# EAGLE board Open Flight Controller (EAGLE 9.0.0)
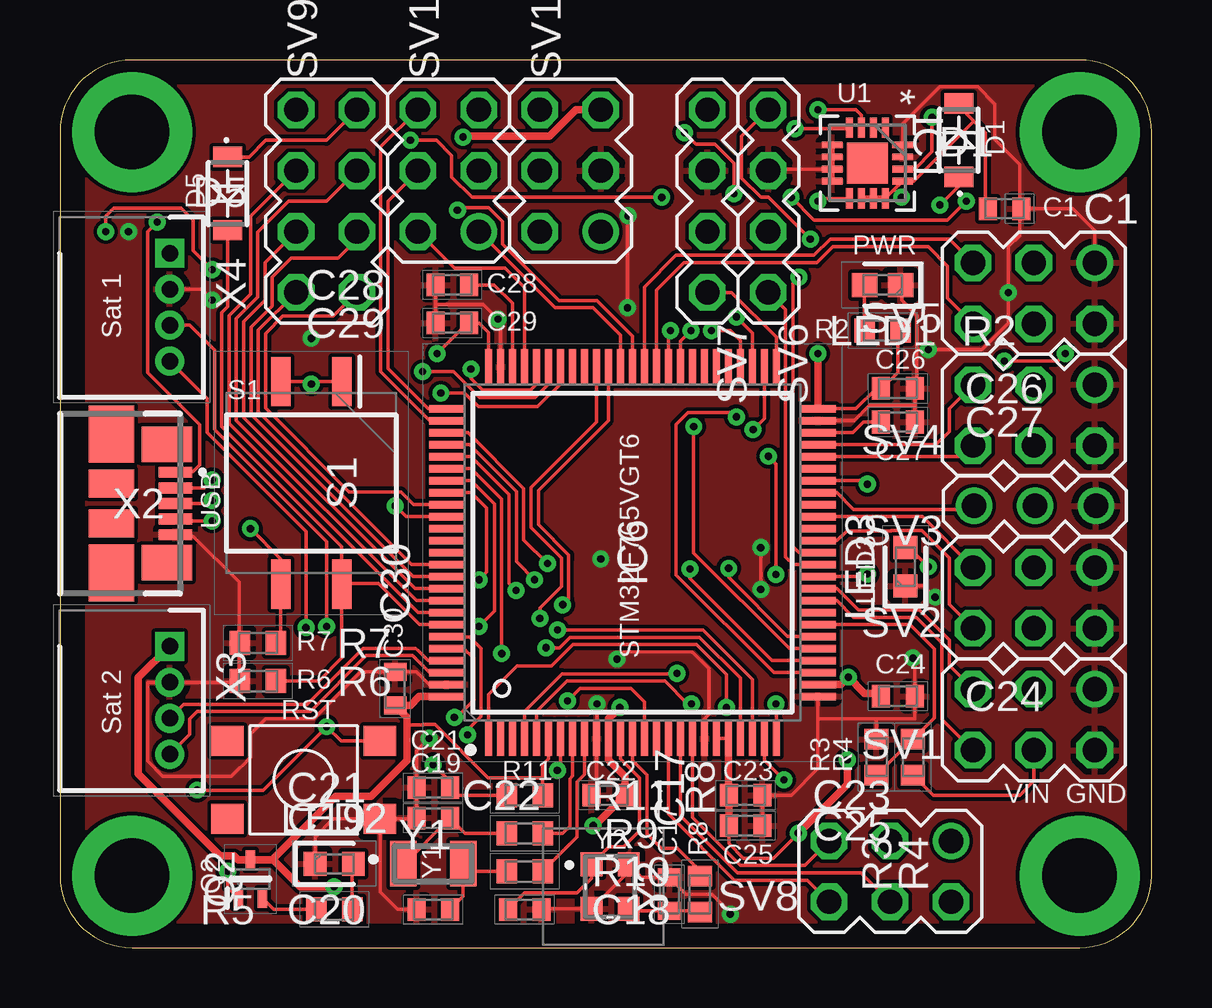
[diagram p2: board, top side]
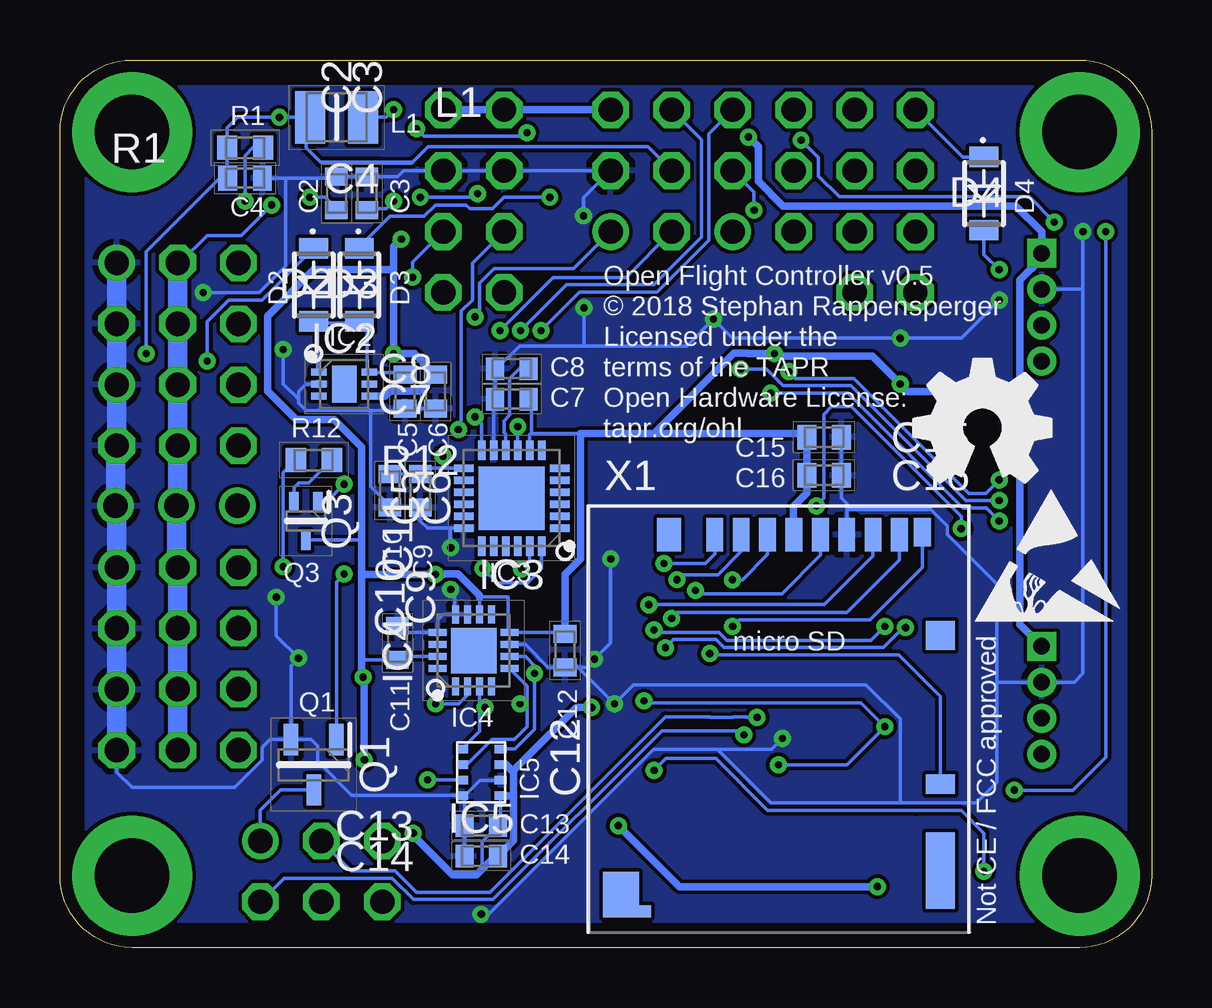
[diagram p3: board, bottom side, seen from below]

Size 45.5 x 37 mm. Coordinates in mm from the lower left corner, seen from the top.
Outline: 0,3 arc90 3,0 42.5,0 arc90 45.5,3 45.5,34 arc90 42.5,37 3,37 arc90 0,34 0,3
Copper layers (1*16): Top 0.035mm / dielectric 1.5mm / Bottom 0.035mm
Design rules "default *": minimum track width 6mil, minimum drill 0.3mm, track to track 6mil, track to pad 6mil, pad to pad 6mil, via to via 6mil, smd to smd 6mil, copper to edge 40mil, drill to drill 6mil, minimum pad ring 10mil, minimum via ring 8mil, stop-mask expansion 4mil, vias tented up to drill 3mm, thermal gap 10mil

## Footprints (pad centres in the part's own frame; a part is rotated, then mirrored left to right if it is on the bottom)
CAPC1608X90N = smd 0.75 x 0.94: 1 -0.7,0; 2 0.7,0
CAPC1608X100N = smd 0.79 x 1.02: 1 -0.72,0; 2 0.72,0
PMDU = smd 1.2 x 0.85: 1 0,1.525; 2 0,-1.525
RGT16_1P7X1P7 = smd 0.85 x 0.28: 1 -1.475,0.75; 2 -1.475,0.25; 3 -1.475,-0.25; 4 -1.475,-0.75; 9 1.475,-0.75; 10 1.475,-0.25; 11 1.475,0.25; 12 1.475,0.75 | smd 0.28 x 0.85: 5 -0.75,-1.475; 6 -0.25,-1.475; 7 0.25,-1.475; 8 0.75,-1.475; 13 0.75,1.475; 14 0.25,1.475; 15 -0.25,1.475; 16 -0.75,1.475 | smd 1.7 x 1.7: 17 0,0
SON50P200X200X80-7N = smd 0.65 x 0.3: 1 -1.05,0.5; 2 -1.05,0; 3 -1.05,-0.5; 4 1.05,-0.5; 5 1.05,0; 6 1.05,0.5 | smd 1.02 x 1.55: 7 0,0
QFN50P400X400X95-25N = smd 0.8 x 0.3: 1 -2,1.25; 2 -2,0.75; 3 -2,0.25; 4 -2,-0.25; 5 -2,-0.75; 6 -2,-1.25; 13 2,-1.25; 14 2,-0.75; 15 2,-0.25; 16 2,0.25; 17 2,0.75; 18 2,1.25 | smd 0.3 x 0.8: 7 -1.25,-2; 8 -0.75,-2; 9 -0.25,-2; 10 0.25,-2; 11 0.75,-2; 12 1.25,-2; 19 1.25,2; 20 0.75,2; 21 0.25,2; 22 -0.25,2; 23 -0.75,2; 24 -1.25,2 | smd 2.75 x 2.65: 25 0,0
QFN50P300X300X80-17N = smd 0.75 x 0.3: 1 -1.5,0.75; 2 -1.5,0.25; 3 -1.5,-0.25; 4 -1.5,-0.75; 9 1.5,-0.75; 10 1.5,-0.25; 11 1.5,0.25; 12 1.5,0.75 | smd 0.3 x 0.75: 5 -0.75,-1.5; 6 -0.25,-1.5; 7 0.25,-1.5; 8 0.75,-1.5; 13 0.75,1.5; 14 0.25,1.5; 15 -0.25,1.5; 16 -0.75,1.5 | smd 1.9 x 1.9: 17 0,0
8-PIN-METAL-LID-LGA = smd 0.5 x 0.35: 1 0.8,0.975; 2 0.8,0.325; 3 0.8,-0.325; 4 0.8,-0.975; 5 -0.8,-0.975; 6 -0.8,-0.325; 7 -0.8,0.325; 8 -0.8,0.975
QFP50P1600X1600X160-100N = smd 1.475 x 0.3: 1 -7.738,6; 2 -7.738,5.5; 3 -7.738,5; 4 -7.738,4.5; 5 -7.738,4; 6 -7.738,3.5; 7 -7.738,3; 8 -7.738,2.5; 9 -7.738,2; 10 -7.738,1.5; 11 -7.738,1; 12 -7.738,0.5; 13 -7.738,0; 14 -7.738,-0.5; 15 -7.738,-1; 16 -7.738,-1.5; 17 -7.738,-2; 18 -7.738,-2.5; 19 -7.738,-3; 20 -7.738,-3.5; 21 -7.738,-4; 22 -7.738,-4.5; 23 -7.738,-5; 24 -7.738,-5.5; 25 -7.738,-6; 51 7.738,-6; 52 7.738,-5.5; 53 7.738,-5; 54 7.738,-4.5; 55 7.738,-4; 56 7.738,-3.5; 57 7.738,-3; 58 7.738,-2.5; 59 7.738,-2; 60 7.738,-1.5; 61 7.738,-1; 62 7.738,-0.5; 63 7.738,0; 64 7.738,0.5; 65 7.738,1; 66 7.738,1.5; 67 7.738,2; 68 7.738,2.5; 69 7.738,3; 70 7.738,3.5; 71 7.738,4; 72 7.738,4.5; 73 7.738,5; 74 7.738,5.5; 75 7.738,6 | smd 0.3 x 1.475: 26 -6,-7.738; 27 -5.5,-7.738; 28 -5,-7.738; 29 -4.5,-7.738; 30 -4,-7.738; 31 -3.5,-7.738; 32 -3,-7.738; 33 -2.5,-7.738; 34 -2,-7.738; 35 -1.5,-7.738; 36 -1,-7.738; 37 -0.5,-7.738; 38 0,-7.738; 39 0.5,-7.738; 40 1,-7.738; 41 1.5,-7.738; 42 2,-7.738; 43 2.5,-7.738; 44 3,-7.738; 45 3.5,-7.738; 46 4,-7.738; 47 4.5,-7.738; 48 5,-7.738; 49 5.5,-7.738; 50 6,-7.738; 76 6,7.738; 77 5.5,7.738; 78 5,7.738; 79 4.5,7.738; 80 4,7.738; 81 3.5,7.738; 82 3,7.738; 83 2.5,7.738; 84 2,7.738; 85 1.5,7.738; 86 1,7.738; 87 0.5,7.738; 88 0,7.738; 89 -0.5,7.738; 90 -1,7.738; 91 -1.5,7.738; 92 -2,7.738; 93 -2.5,7.738; 94 -3,7.738; 95 -3.5,7.738; 96 -4,7.738; 97 -4.5,7.738; 98 -5,7.738; 99 -5.5,7.738; 100 -6,7.738
INDC2520X120N = smd 1.25 x 2.2: 1 -1.1,0; 2 1.1,0
LEDC1608X100N = smd 1.05 x 1: 1 -0.75,0; 2 0.75,0
LEDC1608X100N' = smd 0.95 x 1: 1 -0.8,0; 2 0.8,0
SOT95P237X112-3N = smd 1.3 x 0.6: 1 -1.05,0.95; 2 -1.05,-0.95; 3 1.05,0
SOT50P160X90-3N = smd 0.8 x 0.4: 1 -0.8,0.5; 2 -0.8,-0.5; 3 0.8,0
RESC1608X50N = smd 0.85 x 1: 1 -0.75,0; 2 0.75,0
SOP254P930X455-4N = smd 2.05 x 0.8: 1 -4.225,2.54; 2 -4.225,0; 3 4.225,0; 4 4.225,2.54
TS-1187-3.8 = smd 1.35 x 1.25: P$1 -3.175,1.625; P$2 3.175,1.625; P$3 -3.175,-1.625; P$4 3.175,-1.625
MA03-2 = drill 1.016: 1 -2.54,-1.27 | drill 1.016 octagon: 2 -2.54,1.27; 3 0,-1.27; 4 0,1.27; 5 2.54,-1.27; 6 2.54,1.27
MA03-1 = drill 1.016: 1 -2.54,0; 2 0,0; 3 2.54,0
MA04-1 = drill 1.016 octagon: 1 -3.81,0; 2 -1.27,0; 3 1.27,0; 4 3.81,0
MA04-2 = drill 1.016 octagon: 1 -3.81,-1.27; 2 -3.81,1.27; 3 -1.27,-1.27; 4 -1.27,1.27; 5 1.27,-1.27; 6 1.27,1.27; 7 3.81,-1.27; 8 3.81,1.27
DM3BT-DSF-PEJS = smd 0.7 x 1.4: 1 -10,0.7; 2 -8.9,0.7; 3 -7.8,0.7; 4 -6.7,0.7; 5 -5.6,0.7; 6 -4.5,0.7; 7 -3.4,0.7; 8 -2.3,0.7 | smd 1.2 x 0.8: A -0.6,-9.7 | smd 0.7 x 1.2: B -1.35,0.8 | smd 1.2 x 3.2: P$1 -0.6,-13.3 | smd 1.2 x 1.2: P$3 -0.6,-3.5 | smd 1 x 1.4: P$13 -11.9,0.7 | smd 1.5 x 1.9: P$14 -13.9,-14.3 | smd 0.5 x 0.5: P$15 -12.9,-15
0473460001 = smd 1.38 x 0.45: 1 4.81,1.3; 2 4.81,0.65; 3 4.81,0; 4 4.81,-0.65; 5 4.81,-1.3 | smd 2.1 x 1.475: 6 4.45,2.462; 7 4.45,-2.462 | smd 1.9 x 2.375: 8 2.15,2.902; 9 2.15,-2.902 | smd 1.9 x 1.175: 10 2.15,0.838; 11 2.15,-0.838
SHDR4W50P0X150_1X4_750X600X370 = drill 0.7 pad 1.1 square: 1 0,0 | drill 0.7 pad 1.1: 2 1.5,0; 3 3,0; 4 4.5,0
ABS-07 = smd 1.1 x 1.9: 1 -1.25,0; 2 1.25,0
MCSJK7E2500101060B10 = smd 1 x 0.9: 1 -0.925,-0.388; 2 0.925,-0.388; 3 0.925,1.162; 4 -0.925,1.162

## Placement (x,y rotation side)
C1  10uF  [CAPC1608X90N]  39.37,30.8 0 top
C2  0.1uF  [CAPC1608X90N]  33.97,31.43 90 bottom
C3  3.3nF  [CAPC1608X90N]  32.7,31.43 90 bottom
C4  22uF  [CAPC1608X100N]  37.78,32.07 0 bottom
C5  1uF  [CAPC1608X90N]  31.11,23.18 270 bottom
C6  1uF  [CAPC1608X90N]  29.84,23.18 270 bottom
C7  10nF  [CAPC1608X90N]  26.67,22.86 180 bottom
C8  0.47uF  [CAPC1608X90N]  26.67,24.13 180 bottom
C9  0.1uF  [CAPC1608X90N]  30.48,19.05 270 bottom
C10  2.2uF  [CAPC1608X90N]  31.75,19.05 270 bottom
C11  0.1uF  [CAPC1608X90N]  31.43,12.7 90 bottom
C12  0.1uF  [CAPC1608X90N]  24.45,12.38 270 bottom
C13  0.1uF  [CAPC1608X90N]  27.94,5.08 180 bottom
C14  0.1uF  [CAPC1608X90N]  27.94,3.81 180 bottom
C15  22uF  [CAPC1608X100N]  13.65,21.27 0 bottom
C16  22uF  [CAPC1608X100N]  13.65,19.68 0 bottom
C17  3pF  [CAPC1608X90N]  25.4,2.22 90 top
C18  3pF  [CAPC1608X90N]  19.37,1.59 0 top
C19  1.2pF  [CAPC1608X90N]  15.56,5.4 180 top
C20  1.2pF  [CAPC1608X90N]  15.56,1.59 180 top
C21  0.1uF  [CAPC1608X90N]  15.56,6.67 180 top
C22  0.1uF  [CAPC1608X90N]  22.86,6.35 180 top
C23  0.1uF  [CAPC1608X90N]  28.57,6.35 0 top
C24  0.1uF  [CAPC1608X90N]  34.92,10.48 0 top
C25  0.1uF  [CAPC1608X90N]  28.57,5.08 0 top
C26  0.1uF  [CAPC1608X90N]  34.92,23.3 0 top
C27  2.2uF  [CAPC1608X90N]  34.92,21.91 0 top
C28  2.2uF  [CAPC1608X90N]  16.35,27.62 180 top
C29  0.1uF  [CAPC1608X90N]  16.35,26.04 180 top
C30  0.1uF  [CAPC1608X90N]  13.97,10.79 90 top
D1  [PMDU]  37.47,33.66 180 top
D2  [PMDU]  34.92,27.62 0 bottom
D3  [PMDU]  33.02,27.62 0 bottom
D4  [PMDU]  6.99,31.43 0 bottom
D5  [PMDU]  6.99,31.43 0 top
IC1  TPS62133RGTT  [RGT16_1P7X1P7]  33.66,32.7 270 top
IC2  LDL112PU33R  [SON50P200X200X80-7N]  33.66,23.5 0 bottom
IC3  ICM-20689-V2.2  [QFN50P400X400X95-25N]  26.67,18.73 180 bottom
IC4  AK8963N  [QFN50P300X300X80-17N]  28.26,12.38 90 bottom
IC5  BMP280  [8-PIN-METAL-LID-LGA]  27.94,7.3 180 bottom
IC6  STM32F765VGT6  [QFP50P1600X1600X160-100N]  23.86,16.46 90 top
L1  2.2uH  [INDC2520X120N]  33.97,34.61 0 bottom
LED1  GREEN  [LEDC1608X100N]  34.29,27.62 180 top
LED2  BLUE  [LEDC1608X100N']  11.43,3.49 0 top
LED3  BLUE  [LEDC1608X100N']  35.24,15.88 90 top
Q1  IRLML6244TRPBF  [SOT95P237X112-3N]  34.92,7.62 270 bottom
Q2  SDTC114EET1G  [SOT50P160X90-3N]  7.94,2.86 90 top
Q3  SDTC114EET1G  [SOT50P160X90-3N]  35.24,17.78 270 bottom
R1  100k  [RESC1608X50N]  37.78,33.34 180 bottom
R2  1k  [RESC1608X50N]  34.29,25.72 0 top
R3  10k  [RESC1608X50N]  34.04,7.94 270 top
R4  10k  [RESC1608X50N]  35.56,7.94 270 top
R5  1k  [RESC1608X50N]  11.43,1.59 180 top
R6  10k  [RESC1608X50N]  8.26,11.11 0 top
R7  10k  [RESC1608X50N]  8.26,12.7 0 top
R8  0  [RESC1608X50N]  26.67,2.22 90 top
R9  0  [RESC1608X50N]  19.37,4.76 0 top
R10  0  [RESC1608X50N]  19.37,3.17 0 top
R11  10k  [RESC1608X50N]  19.37,6.35 0 top
R12  1k  [RESC1608X50N]  34.92,20.32 0 bottom
S1  A6SN-2101  [SOP254P930X455-4N]  9.21,19.37 270 top
S2  TS-1187  [TS-1187-3.8]  10.16,6.99 0 top
SV1  MA03-2  [MA03-2]  40.59,9.49 180 top
SV2  MA03-2  [MA03-2]  40.59,14.57 180 top
SV3  MA03-1  [MA03-1]  40.64,18.41 180 top
SV4  MA03-2  [MA03-2]  40.59,22.2 180 top
SV5  MA03-2  [MA03-2]  40.59,27.27 180 top
SV6  MA04-1  [MA04-1]  29.53,31.11 270 top
SV7  MA04-1  [MA04-1]  26.99,31.11 270 top
SV8  MA03-2  [MA03-2]  34.61,3.17 180 top
SV9  [MA04-2]  11.11,31.11 90 top
SV10  MA03-2  [MA03-2]  16.19,32.38 90 top
SV11  MA03-2  [MA03-2]  21.27,32.38 90 top
X1  DM3BT-DSF-PEJS  [DM3BT-DSF-PEJS]  8.21,16.51 0 bottom
X2  0473460001  [0473460001]  0,18.51 0 top
X3  S4B-ZR(LF)(SN)  [SHDR4W50P0X150_1X4_750X600X370]  4.58,12.56 270 top
X4  S4B-ZR(LF)(SN)  [SHDR4W50P0X150_1X4_750X600X370]  4.58,28.94 270 top
Y1  ABS07-32.768KHZ-T  [ABS-07]  15.56,3.49 0 top
Y2  MCSJK-7E-25.00-8-10-60-B-10  [MCSJK7E2500101060B10]  22.54,2.54 270 top

## Tracks (layer width: path | path; a pad name or v marks a point on that pad's centre or on a via)
3.3V  (via drill 0.3)
  Top 0.152: IC6.75 17.86,25.64 17.46,26.04 C29.1 16.99,26.04 v15.72,24.77 | IC6.50 33.18,22.46 34.02,23.3 C26.1 34.29,23.34 34.92,23.97 34.92,25.72 R2.2 | S1.2 10.38,23.59 v10.48,23.5 10.57,23.59 S1.1 | 34.1,10.6 C24.1 | 22.86,8.57 IC6.11 | IC6.21 IC6.20 | IC6.6 20.36,7.87 20.12,7.62 20.12,7.08 | 20.12,7.08 R11.2 | C30.1 13.98,10.09 14.55,9.53 14.55,9.29 | 8.84,3.66 8.86,3.68 | 8.86,3.68 8.94,3.76 | 8.86,3.68 9.92,2.62 | v31.27,29.53 29.53,31.27 29.21,31.27 28.42,32.07 28.42,33.81 SV6.1 | C25.1 27.88,4.34 28.49,3.73 29.75,3.73 30.79,4.77 v30.77,4.77 | v29.53,20.48 29.84,20.16 v29.84,15.56 | 20.12,7.08 17.84,7.08 15.62,9.3 15.14,9.3 15.13,9.29 14.55,9.29 | 14.55,8.57 14.55,9.29
  Top 0.305: IC6.27 32.55,10.96 v32.86,11.27 33.53,10.6 34.1,10.6 | X3.1 3.27,11.25 3.27,7.23 6.67,3.83 7.26,3.83 7.43,3.66 Q2.3 8.84,3.66 | IC6.100 14.97,10.46 14.61,10.1 C30.1 14.48,9.59 14.48,7.81 12.97,6.3 11.48,6.3 8.94,3.76 8.94,3.6 9.92,2.62 10,2.54 v11.43,2.54 | v22.23,5.08 22.29,5.08 C22.1 23.56,7.13 22.86,7.83 22.86,8.57 | v23.34,10 23.1,9.77 23.08,9.77 22.86,9.54 IC6.11 | v32.81,7.83 32.81,6.79 30.79,4.77 | IC6.21 27.86,6.37 C23.1 C25.1 | v31.59,24.77 31.6,24.76 IC6.50 | SV11.5 21.51,34.92 20.4,33.81 16.83,33.81 v16.8,33.79
  Bottom 0.152: 14.92,17.46 14.92,17.23 X1.4 | IC5.6 27.04,7.63 26.66,7.25 26.67,7.3 25.24,8.73 | C14.1 26.66,4.39 26.66,6.35 26.99,6.35 IC5.8 27.14,5.18 C13.1 27.91,4.41 27.91,3.37 28.17,3.11 29.33,3.11 | C12.1 24.5,13.13 IC4.8 26.83,13.18 26.83,14.61 28.01,14.61 IC4.10 | IC4.15 31.3,12.13 C11.1 32.86,12 | IC3.8 25.92,21.39 25.83,21.48 | 25.83,21.48 25.83,22.72 C7.1 | C10.1 C9.1 30.25,19.98 29.53,19.98 | IC3.13 29.53,19.98 | X3.1 5.41,13.39 5.41,23.18 6.99,23.18 7.3,23.18 | 23.81,21.43 25.88,21.43 25.83,21.48 | v29.53,20.48 29.53,19.98 | v30.77,4.77 30.77,4.55 | 32.81,11.22 v32.86,11.27 32.86,12 | 32.86,12 32.86,15.56 32.86,19.21 | 32.92,17.14 32.92,16.98 Q3.3
  Bottom 0.305: SV11.5 SV7.1 SV6.1 | 5.49,23.18 5.49,27.82 4.58,28.73 X4.1 4.58,29.84 5.65,30.91 15.35,30.91 16.4,31.95 16.4,33.38 v16.8,33.79 | 5.49,23.18 6.99,23.18 10.16,23.18 v10.48,23.5 11.64,24.66 15.61,24.66 v15.72,24.77 16.85,24.77 16.86,24.77 17.4,24.77 20.64,21.54 20.64,21.43 | 5.49,23.18 5.49,13.47 X3.1 | 32.86,15.56 v29.84,15.56 29.51,15.56 29.48,15.58 28.92,15.58 28.01,14.67 28.01,14.61 | v32.81,7.83 32.81,11.22 32.92,11.34 32.92,17.14 32.92,20.86 34.07,22 35.66,22 36.85,23.2 36.85,26.33 34.92,28.26 31.59,28.26 | v11.43,2.54 19.68,2.54 v22.23,5.08 | v23.34,10 23.97,10 25.24,8.73 26.59,7.39 26.59,7.3 | 26.59,7.3 26.59,6.35 | 26.59,6.35 26.59,4.46 C14.1 27.36,3.81 28.14,3.04 29.14,3.04 30.77,4.67 v30.77,4.77 | IC5.6 26.91,7.63 26.59,7.3 | IC5.8 26.61,6.33 26.59,6.35 | 20.64,21.43 23.81,21.43 23.81,16.19 24.45,15.56 C12.1 | 20.64,21.43 14.53,21.43 C15.1 C16.1 14.37,18.94 14.92,18.39 14.92,17.46 | 31.59,28.26 v31.59,24.77 30.73,24.77 30.34,24.38 30.34,24.37 C6.1 30.34,23.38 30.52,23.2 31.75,23.2 31.95,23 IC2.4 | 31.59,28.26 31.59,29.21 v31.27,29.53
5V  (via drill 0.3)
  Top 0.152: v36.35,34.61 36.35,33.18 35.63,32.45 IC1.14 | v39.37,24.45 v39.38,24.46 41.6,24.46 v41.91,24.77
  Bottom 0.152: L1.1 35.24,34.61 | 35.24,34.61 v36.35,34.61 38.1,34.61 38.53,34.17 R1.2 38.53,32.38 | 38.53,32.38 38.53,32.1 C4.1 38.58,32.07 | SV11.4 20.99,33.38 30.16,33.38 30.8,32.74 | 30.8,32.74 30.84,32.7 32.1,32.7 32.14,32.74 | 35.24,34.61 35.24,33.34 34.64,32.74 32.14,32.74 | 32.14,32.74 30.8,32.74 | v41.91,24.77 41.91,29.01 38.53,32.38 | v39.37,24.45 39.37,26.09 38.47,27 37.08,27 D2.1
!RST  (via drill 0.3)
  Top 0.152: v21.15,10.28 21.68,10.8 23.8,10.8 24.36,10.25 IC6.14 | R11.1 16.57,6.35 C21.1 16.26,6.92 v15.56,7.62 | S2.P$2 11.71,8.61 v11.11,9.21 8.47,6.56 v5.71,6.56 | v6.35,28.26 5.56,29.05 5.56,30.32 5.05,30.82 2.25,30.82 1.91,30.48 1.91,30.16 v1.91,29.84
  Bottom 0.152: v21.15,10.28 21.08,10.2 12.11,10.2 v11.11,9.21 12.7,7.62 v15.56,7.62 | v6.35,28.26 6.99,28.89 D4.2 | v5.71,6.56 3.28,6.56 1.91,7.94 v1.91,29.84
ADC2
  Top 0.152: IC6.16 25.36,5.57 28.11,2.81 31.16,2.81 SV8.6
ADC3
  Top 0.152: IC6.17 25.86,5.5 28.24,3.12 33.4,3.12 SV8.4
ADC4
  Top 0.152: IC6.18 26.36,5.43 28.36,3.42 31.04,3.42 SV8.5 32,4.38
ADC5
  Top 0.152: IC6.32 35.43,13.46 36.45,12.44 36.45,9.58 R4.1 35.54,8.69 R3.2
BOOT
  Top 0.152: IC6.94 14.99,13.46 14.62,13.84 14.62,13.85 13.28,15.19 11.8,15.19 11.75,15.24 | 11.43,15.56 11.75,15.24 | 11.75,15.24 S1.4 | S1.4 11.75,12.06 10.79,11.11 R6.2 | S1.4 11.75,16.72 6.74,21.72 6.74,26.48 6.99,26.72 D5.2
BOOT_PIN
  Top 0.152: SV9.7 11.11,33.66 8.57,33.66 7.88,32.96 D5.1
GND  (via drill 0.3)
  Top 0.152: C29.2 15.65,26.8 | 15.65,26.8 C28.2 | 15.65,26.8 17.65,26.8 v18.26,26.19 18.36,26.09 IC6.74 | IC6.49 33.11,21.96 33.76,22.61 35.62,22.61 C26.2 | C26.2 C27.2 | C25.2 C23.2 30.48,6.35 31.6,7.47 31.6,9.53 | C18.2 20.09,1.61 Y2.2 23.7,3.17 Y2.4 24.25,2.92 C17.2 26.1,2.22 27.17,2.22 27.94,1.45 v27.94,1.39 | LED2.1 10.63,4.6 11.39,5.36 S2.P$4 | C20.2 14.07,1.59 13.34,2.32 S2.P$4 | C22.2 22.36,6.55 IC6.10 22.38,8.73 v22.38,10.16 | IC6.19 26.86,9.53 27.05,9.72 27.05,11.62 26.35,12.32 23.52,12.32 v23.22,12.02 | 35.72,24.92 35.72,23.34 C26.2 | 35.72,24.92 35.72,26.35 35.08,26.99 35.08,27.62 LED1.1 | IC1.15 35.08,33.02 35.08,33.34 IC1.16 35.13,34.34 36.67,35.88 38.26,35.88 38.97,35.16 38.97,33.67 40.01,32.64 40.01,30.8 | 35.72,24.92 v36.2,24.92 38.42,24.92 39.53,26.04 v39.53,27.3 39.53,29.21 40.01,29.69 40.01,30.8 | 40.01,30.8 C1.2 42.23,30.8 43.18,29.84 43.13,29.8 SV5.1 | 7.46,12.7 7.46,11.11 R6.1 7.5,11.06 X3.2 3.65,11.06 3.65,7.78 4.29,7.14 7.14,7.14 7.94,7.94 7.94,8.9 8.57,9.53 10.56,9.53 12.53,11.49 C30.2 14.86,11.49 15.39,10.96 IC6.99 | 7.46,12.7 7.46,15.24 5.56,17.14 4.92,17.14 X2.5 | 7.46,12.7 R7.1 | IC1.8 32.23,32.07 32.23,32.38 IC1.7 | IC1.5 32.23,33.34 32.23,33.02 IC1.6 32.23,32.86 32.23,32.54 IC1.7 | v29.21,16.67 v29.21,14.92 | v35.56,12.06 35.62,12 C24.2 35.62,9.53 34.04,9.53 | IC1.7 29.59,32.45 SV6.2 | 31.6,9.53 IC6.26 | 34.04,9.53 31.6,9.53 | R3.1 34.04,9.53 | S2.P$4 14.82,5.36 C19.2 C21.2 14.86,8.19 v15.38,8.72 | v23.68,30.5 23.65,30.48 v23.65,26.67 | v36.48,14.61 36.01,15.07 LED3.1 | v6.35,26.99 5.9,27.44 X4.2
  Bottom 0.152: C15.2 C16.2 12.93,18.73 12.71,18.51 12.71,18.26 | X1.6 12.71,18.26 | IC5.1 28.64,6.33 27.99,6.98 IC5.7 | C14.2 C13.2 28.64,6.23 IC5.1 | IC4.7 26.1,12.63 25.15,11.68 C12.2 23.97,11.68 | C11.2 31.16,13.13 IC4.13 29.76,13.65 29.53,13.88 IC4.12 | IC4.12 IC4.11 | IC3.11 27.42,22.81 C7.2 C8.2 27.3,24.13 26.35,25.08 23.65,25.08 | C6.2 C5.2 31.11,22.38 32.54,22.38 | 29.21,17.48 30.18,17.48 30.48,17.78 C9.2 C10.2 31.75,18.41 32.54,19.21 32.54,22.38 | 29.21,17.48 IC3.18 | 36.09,32.07 34.04,32.07 C2.2 C3.2 31.43,32.13 31.18,32.38 SV6.2 SV7.2 SV11.3 23.68,31.25 v23.68,30.5 | 18.1,8.26 20.77,8.26 27.62,1.39 v27.94,1.39 | 23.97,11.68 23.56,11.68 v23.22,12.02 22.54,12.7 v22.54,16.19 | IC5.1 28.89,6.35 33.34,6.35 34.77,7.78 34.77,8.41 35.02,8.67 Q1.2 | 23.97,11.68 23.97,11.75 v22.38,10.16 21.59,10.95 11.91,10.95 10.48,9.53 10.48,6.03 | 18.1,8.26 15.88,6.03 10.48,6.03 | 12.71,18.26 9.21,18.26 8.52,17.57 8.52,17.22 6.44,15.15 6.44,11.06 | 23.65,25.08 19.37,25.08 v18.26,26.19 17.46,25.4 v10.48,25.4 7.94,25.4 v6.35,26.99 | v29.21,14.92 29.05,14.92 29.05,13.97 IC4.12 | 29.21,17.48 v29.21,16.67 | 32.54,22.38 35.24,22.38 35.56,22.7 35.56,22.86 | v23.65,26.67 23.65,25.08 | Q1.2 35.88,11.75 v35.56,12.06 36.48,12.99 v36.48,14.61 | 36.09,32.07 C4.2 | 6.44,11.06 X3.2 3.23,11.06 2.86,11.43 2.86,27.44 | 10.48,6.03 7.3,6.03 6.44,6.89 6.44,11.06 | IC2.2 35.24,23.5 35.56,23.18 35.56,22.86 | 35.56,22.86 36.2,23.5 v36.2,24.92 | v39.53,27.3 37.2,27.3 36.09,28.41 36.09,32.07 | Q1.2 36.73,8.67 37.06,8.34 37.06,7.82 38.21,6.67 42.5,6.67 43.13,7.3 SV1.2 | 2.86,27.44 v2.86,29.84 | X4.2 2.86,27.44 | v15.38,8.72 15.85,8.26 18.1,8.26
  Bottom 0.813: SV1.2 SV1.1 SV2.2 SV2.1 43.13,18.37 SV3.1 43.18,20.88 SV4.2 SV4.1 SV5.2 SV5.1
  pour Top: 2.86,0 42.55,0 arc90 45.4,2.86 45.4,34.29 arc90 42.55,37.15 3.17,37.15 arc90 0,33.97 0,2.86 arc90
  pour Bottom: 2.86,0 42.55,0 arc90 45.4,2.86 45.4,34.29 arc90 42.55,37.15 3.17,37.15 arc90 0,33.97 0,2.86 arc90
GPIO3_LED  (via drill 0.3)
  Top 0.152: IC6.7 20.86,7.51 v20.73,7.38 | Q2.1 6.99,2.51 v6.99,3.17
  Bottom 0.152: v20.73,7.38 20.23,7.88 18.15,7.88 16,5.73 9.84,5.73 9.83,5.71 7.94,5.71 6.99,4.76 v6.99,3.17
GPIO6(GYRO_INT)  (via drill 0.3)
  Top 0.152: v28.19,22.12 28.02,22.3 26.18,22.3 25.68,21.8 25.68,15.54 29.75,11.46 IC6.28
  Bottom 0.152: v28.19,22.12 27.92,21.85 IC3.12
GPIO7  (via drill 0.3)
  Top 0.152: v33.66,15.57 33.55,15.46 IC6.36
  Bottom 0.152: Q1.1 33.98,15.25 v33.66,15.57
GPIO11  (via drill 0.3)
  Top 0.152: IC6.81 17.14,19.96 18.41,18.69 v18.41,12.25
  Bottom 0.152: X1.A 8.81,10.48 10.53,12.2 18.36,12.2 v18.41,12.25
GPIO12  (via drill 0.3)
  Top 0.152: IC6.82 17.14,19.46 18.11,18.5 18.11,14.04 v17.46,13.39
  Bottom 0.152: X1.B 9.56,15.84 11.75,13.65 17.2,13.65 v17.46,13.39
GPIO13  (via drill 0.3)
  Top 0.152: v13.97,18.42 14.42,17.96 IC6.85 | v7.94,17.46 9.21,16.19 S1.3 9.21,12.9 R7.2
  Bottom 0.152: v13.97,18.42 13.65,18.73 13.65,22.23 13.34,22.54 12.52,22.54 7.94,17.96 v7.94,17.46
JTCK-SWCLK
  Top 0.152: IC6.76 15.34,22.46 13.68,24.13 13.68,31.11 14.92,32.36 SV10.4
JTDI/PWM21
  Top 0.152: IC6.77 15.41,21.96 13.37,24 13.37,33.38 SV10.6
JTDO/SPI3,6_SCK
  Top 0.152: IC6.89 14.66,15.96 8.27,22.35 8.27,25.73 SV9.2
JTMS-SWDIO
  Top 0.152: SV10.2 16.45,28.32 17.78,28.32 | IC6.72 19.36,27.52 18.55,28.32 17.78,28.32 | 17.78,28.32
N$1  (via drill 0.3)
  Top 0.152: IC1.10 33.5,31.27 33.81,31.27 IC1.11 33.97,31.27 34.29,31.27 IC1.12 34.45,31.27 34.77,31.59 | 34.77,31.59 35.08,31.91 IC1.13 35.6,31.95 38.1,34.45 | 34.77,31.59 v35.08,31.27 | 38.1,34.45 37.47,35.08 D1.2 | 38.1,34.45 38.58,33.97 38.58,30.8 C1.1
  Bottom 0.152: v35.08,31.27 34.45,31.27 33.97,30.8 C2.1
N$2  (via drill 0.3)
  Top 0.152: IC1.1 34.29,34.29 33.97,34.29 IC1.2 33.81,34.29 33.5,34.29 IC1.3 33.41,34.7 33.18,34.92 v31.59,34.92
  Bottom 0.152: v31.59,34.92 31.91,34.61 L1.2
N$3  (via drill 0.3)
  Top 0.152: IC1.9 31.7,31.23 v31.59,31.11
  Bottom 0.152: v31.59,31.11 31.91,30.8 32.7,30.8 C3.1
N$4  (via drill 0.3)
  Top 0.152: v30.64,34.13 32.86,34.13 IC1.4 | v28.1,31.43 28.1,32.7 27.3,33.5 26.51,33.5 v26.04,33.97 | v30.48,31.27 31.43,30.32 36.99,30.32 v37.78,31.11
  Bottom 0.152: v30.64,34.13 30.32,33.81 26.19,33.81 v26.04,33.97 | v28.1,31.43 28.26,31.27 v30.48,31.27 | R1.1 37.47,33.34 37.78,33.02 v37.78,31.11
N$5
  Bottom 0.152: C5.1 31.11,23.97 32.54,23.97 IC2.6 32.7,24.13 32.7,26.04 33.02,26.04 | 34.77,26.04 34.77,24.13 IC2.1 | 34.77,26.04 34.92,26.04 D2.2 34.77,26.04 | 34.77,26.04 33.02,26.04 | 33.02,26.04 D3.2
N$6
  Top 0.152: R2.1 LED1.2
N$7
  Top 0.152: Y2.3 23.8,1.52 C17.1 26.62,1.52 R8.1
N$8
  Bottom 0.152: IC3.10 26.92,21.4 27,21.48 27,21.96 26.77,22.19 26.77,23.72 26.35,24.13 C8.1
N$9  (via drill 3.1 pad 5)
  other vias: 3,34
N$10
  Top 0.152: C27.1 33.49,21.91 33.04,21.46 IC6.48
N$11
  Top 0.152: C28.1 18.1,27.62 18.86,26.86 IC6.73
N$12  (via drill 3.1 pad 5)
  other vias: 3,3
N$13  (via drill 3.1 pad 5)
  other vias: 42.5,3
N$14  (via drill 3.1 pad 5)
  other vias: 42.5,34
N$15
  Top 0.152: Q2.2 8.91,1.59 R5.2
N$16
  Top 0.152: LED2.2 12.18,3.44 R5.1
N$17
  Bottom 0.152: Q3.2 35.74,19.18 35.56,19.37 35.13,19.37 R12.2
N$18
  Top 0.152: C20.1 16.81,2.14 Y1.2 17.12,3.17 R10.1
N$19
  Top 0.152: Y1.1 14.36,3.49 16.2,5.33 C19.1 16.89,4.76 R9.1
N$20  (via drill 0.3)
  Top 0.152: v36.2,15.88 35.4,16.68 LED3.2
  Bottom 0.152: R12.1 36.2,19.8 v36.2,15.88
NJTRST/SPI3,6_MISO
  Top 0.152: IC6.90 14.73,15.46 7.96,22.23 7.96,25.86 8.85,26.75 8.85,27.94 9.65,28.73 11.59,28.73 12.38,29.53 SV9.3
OSC32_IN
  Top 0.152: IC6.8 21.36,7.15 21.25,7.04 21.25,5.06 20.95,4.76 R9.2
OSC32_OUT
  Top 0.152: IC6.9 21.86,7.22 21.56,6.92 21.56,4.61 R10.2
OSC_IN
  Top 0.152: IC6.12 23.36,7.87 24.16,7.07 24.16,4.86 23.5,4.19 22.88,4.19 Y2.1 22.15,2.89 21.55,2.29 19.37,2.29 C18.1
OSC_OUT
  Top 0.152: IC6.13 23.86,7.8 24.47,7.19 24.47,4.74 25.08,4.13 25.74,4.13 26.67,3.2 R8.2
PWM11
  Top 0.152: IC6.39 32.38,16.96 32.79,17.37 34.64,17.37 34.65,17.38 35.92,17.38 37.06,16.23 37.06,14.3 SV2.6
PWM12
  Top 0.152: SV2.5 35.94,17.96 IC6.41
PWM13/LCD_DE
  Top 0.152: IC6.43 32.38,18.96 33.08,18.27 37.95,18.27 SV3.3
PWM14/LCD_CLK  (via drill 0.3)
  Top 0.152: IC6.44 33.51,19.46 v33.66,19.31
  Bottom 0.152: v33.66,19.31 34.39,18.58 Q3.1
PWM23
  Top 0.152: SV4.6 37.59,20.46 IC6.46
PWM24
  Top 0.152: IC6.47 36.51,20.96 37.06,21.51 37.06,22.47 SV4.5
PWM31/PWM82/USART6_TX  (via drill 0.3)
  Top 0.152: IC6.63 23.86,25.5 22.38,26.98 20.8,26.98 18.45,29.32 18.45,30.25 17.87,30.84 16.66,30.84 v16.57,30.74
  Bottom 0.152: v16.57,30.74 16.57,31.43 16.57,31.49 SV10.3
PWM32/PWM82/USART6_RX
  Top 0.152: IC6.64 23.36,25.54 22.23,26.67 20.64,26.67 SV10.1
PWM32/SPI3,6_MOSI
  Top 0.152: IC6.91 14.8,14.96 7.66,22.1 7.66,26.1 8.55,26.99 8.55,28.55 SV9.4
PWM33
  Top 0.152: SV1.6 36.76,9.52 36.76,12.7 35.69,13.77 33.08,13.77 32.38,14.46 IC6.34
PWM34
  Top 0.152: IC6.35 32.38,14.96 33.27,14.07 35.82,14.07 37.06,12.83 37.06,11.76 SV1.5
PWM41/I2C1_SCL/I2C4_SCL
  Top 0.152: IC6.92 14.87,14.46 7.35,21.97 7.35,26.23 8.24,27.11 8.24,29.83 9.53,31.11 11.11,31.11 SV9.5
PWM41/I2C4_SCL  (via drill 0.3)
  Top 0.152: v26.3,25.72 25.86,25.28 IC6.59
  Bottom 0.152: 19.37,34.29 18.76,33.68 18.76,29.62 20.74,27.63 24.39,27.63 v26.3,25.72 | SV11.6 19.37,34.29 | 19.37,34.29
PWM42/I2C1_SDA/I2C4_SDA
  Top 0.152: IC6.93 14.92,13.96 14.92,13.97 7.05,21.85 7.05,26.35 7.94,27.24 7.94,30.48 SV9.6
PWM42/I2C4_SDA  (via drill 0.3)
  Top 0.152: IC6.60 25.36,25.64 v25.44,25.72
  Bottom 0.152: v25.44,25.72 23.83,27.33 20.62,27.33 18.45,29.49 18.45,33.93 SV10.5
PWM43
  Top 0.152: IC6.61 24.86,27.4 26.01,28.55 31.56,28.55 32.22,29.21 36.2,29.21 36.99,28.42 36.99,27.07 SV5.6
PWM44
  Top 0.152: IC6.62 24.36,27.54 25.68,28.85 31.43,28.85 32.11,29.53 37.07,29.53 SV5.5
PWM101/I2C1_SCL/I2C4_SCL  (via drill 0.3)
  Top 0.152: IC6.95 17.07,12.96 17.55,12.47 17.55,9.63 17,9.07 v17,8.86
  Bottom 0.152: SV8.2 36.16,2.9 31.66,2.9 30.76,2 27.45,2 20.41,9.04 17.17,9.04 v17,8.86
PWM111/I2C1_SDA/I2C4_SDA  (via drill 0.3)
  Top 0.152: IC6.96 16.83,12.46 17.23,12.06 17.25,12.06 17.25,10.32 16.52,9.59 v16.44,9.59
  Bottom 0.152: 26.64,3.25 20.26,9.62 18.41,9.62 18.39,9.59 17.42,9.59 17.4,9.62 16.89,9.62 16.87,9.59 v16.44,9.59 | SV8.3 33.36,3.2 31.53,3.2 30.64,2.31 27.58,2.31 26.64,3.25 | 26.64,3.25
Q_GPIO
  Bottom 0.152: Q1.3 36.29,6.57 37.15,5.71 SV8.1
RST_PIN
  Bottom 0.152: D4.1 7.88,32.96 SV9.8
SDMMC1_CK  (via drill 0.3)
  Top 0.152: IC6.80 17.14,20.46 18.72,18.89 18.72,15.18 v19.01,14.88
  Bottom 0.152: X1.5 13.81,16.36 15.41,14.75 18.88,14.75 v19.01,14.88
SDMMC1_CMD  (via drill 0.3)
  Top 0.152: IC6.83 17.14,18.96 17.78,18.33 17.78,15.65 v17.46,15.33
  Bottom 0.152: X1.3 16.01,16.38 17.05,15.33 v17.46,15.33
SDMMC1_D0  (via drill 0.3)
  Top 0.152: IC6.65 22.86,21.98 19.94,19.05 19.94,17.64 21.21,16.37 21.21,16.19 21.21,14.54 v20.95,14.29
  Bottom 0.152: X1.7 11.61,16.33 13.64,14.3 20.94,14.3 v20.95,14.29
SDMMC1_D1  (via drill 0.3)
  Top 0.152: IC6.66 22.36,21.91 19.63,19.18 19.63,17.51 20.9,16.25 20.9,15.06 20,14.16 v20,13.72
  Bottom 0.152: X1.8 10.51,16.16 12.7,13.97 19.75,13.97 v20,13.72
SDMMC1_D2  (via drill 0.3)
  Top 0.152: v20.32,16 19.33,17 19.33,19.14 17.01,21.46 IC6.78
  Bottom 0.152: X1.1 18.21,16.4 18.6,16 v20.32,16
SDMMC1_D3  (via drill 0.3)
  Top 0.152: v19.78,15.33 19.02,16.09 19.02,19.01 17.08,20.96 IC6.79
  Bottom 0.152: X1.2 17.11,16.51 18.08,15.54 19.57,15.54 v19.78,15.33
SPI1_MISO  (via drill 0.3)
  Top 0.152: IC6.30 30.4,12.46 26.42,16.45 v26.42,21.72
  Bottom 0.152: IC3.9 v26.42,21.71 v26.42,21.72
SPI1_MOSI  (via drill 0.3)
  Top 0.152: IC6.31 30.33,12.96 27.88,15.42 v27.88,15.81
  Bottom 0.152: IC3.24 25.42,15.8 26.02,15.2 27.26,15.2 v27.88,15.81
SPI1_SCK  (via drill 0.3)
  Top 0.152: v26.26,15.78 26.26,15.39 29.68,11.96 IC6.29
  Bottom 0.152: v26.26,15.78 25.92,16.12 IC3.23
SPI2_MISO  (via drill 0.3)
  Top 0.152: IC6.53 28.86,25.62 v28.19,26.29
  Bottom 0.152: SV11.1 24.09,28.3 27.4,28.3 28,27.69 28,26.48 v28.19,26.29
SPI2_MOSI  (via drill 0.3)
  Top 0.152: IC6.54 28.36,25.3 27.94,25.72 v27.16,25.72
  Bottom 0.152: SV11.2 21.91,27.94 24.94,27.94 v27.16,25.72
SPI2_SCK
  Top 0.152: IC6.84 14.75,18.46 14.21,19 12.05,19 8.57,22.48 8.57,25.6 9.28,26.31 11.39,26.31 SV9.1
SPI4_MISO  (via drill 0.3)
  Top 0.152: IC6.4 19.36,9.84 20.93,11.41 25.7,11.41 v25.72,11.43
  Bottom 0.152: IC4.6 26.1,12.13 25.72,11.75 v25.72,11.43 25.72,9.09 26.53,8.28 IC5.5
SPI4_MOSI  (via drill 0.3)
  Top 0.152: IC6.5 19.86,9.84 21.13,11.11 25.21,11.11 26.16,10.16 v26.32,10.16
  Bottom 0.152: IC4.5 26.04,10.91 26.04,10.16 | 26.04,10.16 26.04,9.21 26.56,8.68 27.48,8.68 28.54,7.63 IC5.3 | v26.32,10.16 26.04,10.16
SPI4_SCK  (via drill 0.3)
  Top 0.152: IC6.1 17.86,10.56 19.05,11.75 20.5,11.75 21.38,12.63 26.54,12.63 27.78,11.39 v27.78,10
  Bottom 0.152: IC5.4 28.01,9.01 28.01,10 | v27.78,10 28.01,10 | 28.01,10 IC4.3
UART2_RX(MAG_CS)  (via drill 0.3)
  Top 0.152: v29.84,10.16 29.86,10.14 IC6.25
  Bottom 0.152: IC4.2 28.51,10.53 28.88,10.16 v29.84,10.16
UART2_TX(P+T_CS)  (via drill 0.3)
  Top 0.152: v30.18,6.99 29.36,7.81 IC6.24
  Bottom 0.152: IC5.2 v30.18,6.99
UART4_RX  (via drill 0.3)
  Top 0.152: X4.3 5.4,25.94 6.44,24.9 6.44,21.59 11.11,16.92 v11.11,13.39 | IC6.23 28.86,11.17 26.79,13.24 v20.73,13.24
  Bottom 0.152: v11.11,13.39 11.69,12.81 17.7,12.81 18.04,13.14 20.64,13.14 v20.73,13.24
UART4_TX  (via drill 0.3)
  Top 0.152: v20.26,12.5 20.82,12.5 21.25,12.93 26.67,12.93 28.36,11.24 IC6.22 | X4.4 6.13,22.89 6.13,21.47 10.25,17.35 v10.25,13.34
  Bottom 0.152: v10.25,13.34 10.34,13.34 11.18,12.5 17.83,12.5 18.16,12.83 19.92,12.83 v20.26,12.5
UART5_RX
  Top 0.152: IC6.51 29.86,25.44 28,27.3 SV7.4
UART5_TX  (via drill 0.3)
  Top 0.152: IC6.52 29.36,22.06 v28.89,21.59
  Bottom 0.152: SV7.3 28.31,28.52 28.31,26.99 28.77,26.53 28.77,21.71 v28.89,21.59
UART7_RX
  Top 0.152: IC6.37 30.57,15.96 30.24,16.29 30.24,26.59 SV6.4
UART7_TX  (via drill 0.3)
  Top 0.152: IC6.38 30.8,16.46 30.54,16.72 30.54,27.69 v30.8,27.94
  Bottom 0.152: SV6.3 30.8,28.57 v30.8,27.94
UART8_RX
  Top 0.152: X3.3 5.16,10.14 10.31,10.14 12.64,12.47 14.83,12.47 14.92,12.38 | 14.92,12.38 15.34,11.96 IC6.97 | 14.92,12.38
UART8_TX
  Top 0.152: X3.4 5.41,8.89 5.41,9.53 5.71,9.84 10.44,9.84 12.77,12.17 14.71,12.17 15.41,11.46 IC6.98
USB_5V  (via drill 0.3)
  Top 0.152: X2.1 4.92,19.84 5.56,19.84 5.83,20.12 5.83,21.79 3.65,23.97 3.65,29.85 v4.05,30.24 | v25.08,31.27 17.17,31.27 16.33,32.11 16.33,33.02 15.7,33.65 v14.61,33.65
  Bottom 0.152: v25.08,31.27 26.99,31.27 27.46,30.8 28.42,30.8 28.57,30.96 29.84,30.96 30.32,30.48 31.75,30.48 33.02,29.21 D3.1 | v4.05,30.24 5.1,31.29 13.02,31.29 13.88,32.16 13.88,32.93 v14.61,33.65
USB_DM  (via drill 0.3)
  Top 0.152: IC6.70 20.36,23.49 19.8,22.93 17.49,22.93 16.4,24.02 15.13,24.02 v15.12,24 | v6.35,19.5 6.01,19.16 X2.2
  Bottom 0.152: v15.12,24 14.84,23.73 12.41,23.73 7.62,18.93 6.91,18.93 v6.35,19.5
USB_DP  (via drill 0.3)
  Top 0.152: IC6.71 19.86,23.49 19.61,23.23 17.61,23.23 17.13,23.72 v17.13,24.11 | v6.35,18.64 6.22,18.51 X2.3
  Bottom 0.152: v6.35,18.64 v6.36,18.63 7.75,18.63 12.54,23.42 15.36,23.42 16.05,24.11 v17.13,24.11
USB_ID  (via drill 0.3)
  Top 0.152: IC6.69 20.86,23.49 19.91,22.54 17.45,22.54 16.87,23.12 v15.88,23.12 | v6.35,17.78 4.89,17.78 X2.4
  Bottom 0.152: v15.88,23.12 12.66,23.12 7.87,18.33 6.9,18.33 v6.35,17.78
VIN  (via drill 0.3)
  Top 0.152: SV1.4 40.59,6.94 40.01,6.35 36.4,6.35 R4.2 | D1.1 37.47,31.75 v36.67,30.96
  Bottom 0.152: v36.67,30.96 37.94,29.69 39.37,29.69 40.48,28.57 SV5.3
  Bottom 0.813: SV1.4 SV1.3 SV2.4 SV2.3 40.64,15.89 SV3.2 40.59,18.46 SV4.4 SV4.3 SV5.4 SV5.3

## Text on the board
tPlace: U1 | D1 | D5 | C1 | PWR | C28 | C29 | Sat 1 | R2 | C26 | S1 | C27 | USB | LED3 | R7 | C30 | STM32F765VGT6 | R6 | C24 | RST | Sat 2 | C21 | C19 | R11 | C22 | C23 | R3 | R4 | VIN | GND | Y2 | C17 | R8 | Y1 | C25 | Q2
bPlace: L1 | R1 | D4 | C3 | C2 | C4 | Open Flight Controller v0.5 | D3 | D2 | © 2018 Stephan Rappensperger | Licensed under the | IC2 | terms of the TAPR | C8 | Open Hardware License: | C7 | C6 | C5 | C15 | tapr.org/ohl | R12 | C16 | C9 | C10 | IC3 | Q3 | Not CE / FCC approved | micro SD | C12 | C11 | Q1 | IC4 | IC5 | C13 | C14